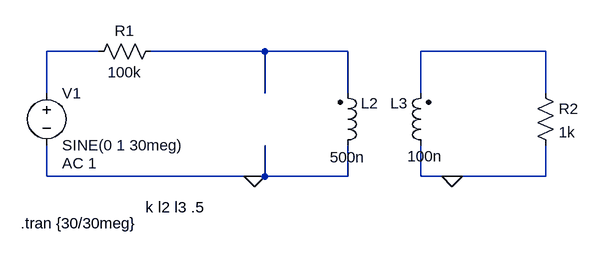
[diagram p0: schematic transformer-antena.asc]
transformer-antena.asc, the LTspice schematic file:
Version 4
SHEET 1 880 680
WIRE 128 80 48 80
WIRE 384 80 208 80
WIRE 512 80 384 80
WIRE 816 80 624 80
WIRE 48 144 48 80
WIRE 384 144 384 80
WIRE 512 144 512 80
WIRE 624 144 624 80
WIRE 816 144 816 80
WIRE 48 272 48 224
WIRE 368 272 48 272
WIRE 384 272 384 224
WIRE 384 272 368 272
WIRE 512 272 512 224
WIRE 512 272 384 272
WIRE 624 272 624 224
WIRE 672 272 624 272
WIRE 816 272 816 224
WIRE 816 272 672 272
FLAG 368 272 0
FLAG 672 272 0
SYMBOL voltage 48 128 R0
WINDOW 123 24 124 Left 2
WINDOW 39 0 0 Left 0
SYMATTR InstName V1
SYMATTR Value SINE(0 1 30meg)
SYMATTR Value2 AC 1
SYMBOL res 224 64 R90
WINDOW 0 0 56 VBottom 2
WINDOW 3 32 56 VTop 2
SYMATTR InstName R1
SYMATTR Value 100k
SYMBOL ind2 496 240 M180
WINDOW 0 36 80 Left 2
WINDOW 3 -12 -3 Left 2
SYMATTR InstName L2
SYMATTR Value 500n
SYMATTR Type ind
SYMBOL ind2 640 240 R180
WINDOW 0 36 80 Left 2
WINDOW 3 -17 -1 Left 2
SYMATTR InstName L3
SYMATTR Value 100n
SYMATTR Type ind
SYMBOL res 800 128 R0
SYMATTR InstName R2
SYMATTR Value 1k
TEXT 200 320 Left 2 !k l2 l3 .5
TEXT 8 344 Left 2 !.tran {30/30meg}

The netlist it stands for:
* transformer-antena.asc
V1 N001 0 SINE(0 1 30meg) AC 1
R1 N002 N001 100k
L2 0 N002 500n
L3 0 N003 100n
R2 N003 0 1k
k l2 l3 .5
.tran {30/30meg}
.backanno
.end